# Altium schematic sheet MSP432.SchDoc: MSP432 Wiring
size A; Date: 3/13/2021; Author: Jesse Fernandez; CompanyName: GVSU; DrawnBy: Jesse Fernandez; Organization: Kennedy Hall of Engineering; Address1: 301 Fulton St. W; Address2: Grand Rapids, MI 49504; DocumentNumber: 1; Revision: 0.1; SheetNumber: 2; SheetTotal: 7; Time: 5:42 am
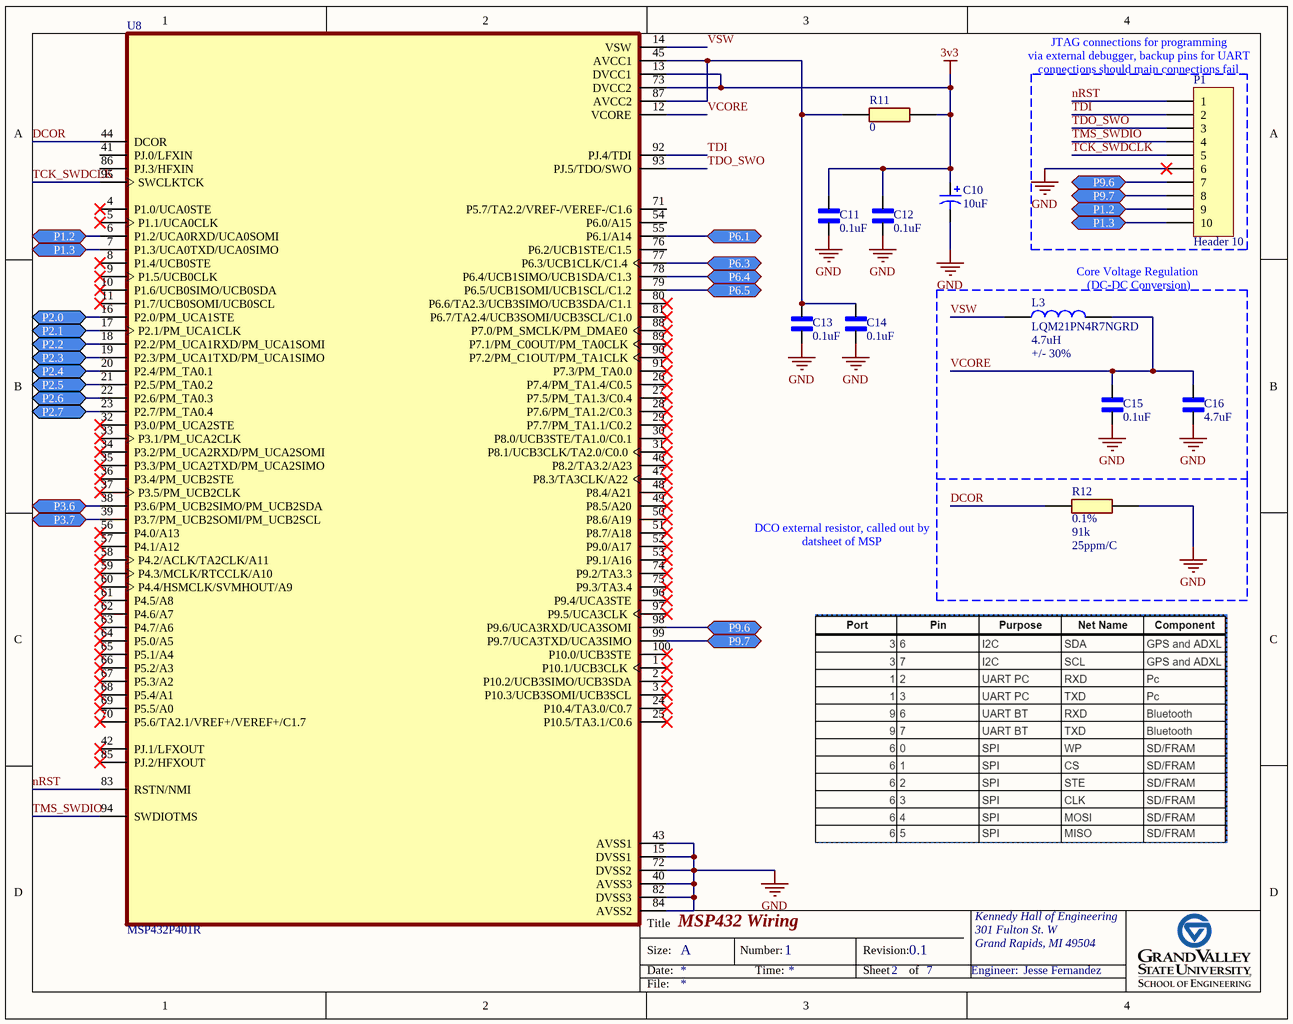
[diagram p0: MSP432.SchDoc]

## Parts
C10  value 10uF  [1206p]  (hidden comment: Cp1206)
C11  value 0.1uF  [CAPC1005X55N]  (hidden comment: Multilayer Ceramic Cap. 0402 (1005 Metric))
C12  value 0.1uF  [CAPC1005X55N]  (hidden comment: Multilayer Ceramic Cap. 0402 (1005 Metric))
C13  value 0.1uF  [CAPC1005X55N]  (hidden comment: Multilayer Ceramic Cap. 0402 (1005 Metric))
C14  value 0.1uF  [CAPC1005X55N]  (hidden comment: Multilayer Ceramic Cap. 0402 (1005 Metric))
C15  value 0.1uF  [CAPC1005X55N]  (hidden comment: Multilayer Ceramic Cap. 0402 (1005 Metric))
C16  value 4.7uF  [CAPC1005X55N]  (hidden comment: Multilayer Ceramic Cap. 0402 (1005 Metric))
L3  LQM21PN4R7NGRD  value 4.7uH  Tolerance: +/- 30%  [LQM21PN4R7NGRD]
P1  Header 10  [HDR1X10]
R11  value 0  [Resistor 0603]  (hidden comment: Resistor 0603)
R12  value 91k  Tolerance: 0.1%  Temperature Coefficient: 25ppm/C  [Resistor 0603]  (hidden comment: Resistor 0603)
U8  MSP432P401R  [MSP432P401R]

## Ports
P1.2 (bidir), P1.3 (bidir), P2.0 (bidir), P2.1 (bidir), P2.2 (bidir), P2.3 (bidir), P2.4 (bidir), P2.5 (bidir), P2.6 (bidir), P2.7 (bidir), P3.6 (bidir), P3.7 (bidir), P6.1 (bidir), P6.3 (bidir), P6.4 (bidir), P6.5 (bidir), P9.6 (bidir), P9.7 (bidir)

## Nets
3v3: C10.1 C11.2 C12.2 R11.2 U8.13(DVCC1) U8.73(DVCC2)
GND: C10.2 C11.1 C12.1 C13.1 C14.1 C15.1 C16.1 P1.6 R12.2 U8.15(DVSS1) U8.40(AVSS3) U8.43(AVSS1) U8.72(DVSS2) U8.82(DVSS3) U8.84(AVSS2)
DCOR: R12.1 U8.44(DCOR)
nRST: P1.1 U8.83(RSTN/NMI)
P1.2: P1.9 U8.6(P1.2/UCA0RXD/UCA0SOMI) ; port P1.2
P1.3: P1.10 U8.7(P1.3/UCA0TXD/UCA0SIMO) ; port P1.3
P2.0: U8.16(P2.0/PM_UCA1STE) ; port P2.0
P2.1: U8.17(P2.1/PM_UCA1CLK) ; port P2.1
P2.2: U8.18(P2.2/PM_UCA1RXD/PM_UCA1SOMI) ; port P2.2
P2.3: U8.19(P2.3/PM_UCA1TXD/PM_UCA1SIMO) ; port P2.3
P2.4: U8.20(P2.4/PM_TA0.1) ; port P2.4
P2.5: U8.21(P2.5/PM_TA0.2) ; port P2.5
P2.6: U8.22(P2.6/PM_TA0.3) ; port P2.6
P2.7: U8.23(P2.7/PM_TA0.4) ; port P2.7
P3.6: U8.38(P3.6/PM_UCB2SIMO/PM_UCB2SDA) ; port P3.6
P3.7: U8.39(P3.7/PM_UCB2SOMI/PM_UCB2SCL) ; port P3.7
P6.1: U8.55(P6.1/A14) ; port P6.1
P6.3: U8.77(P6.3/UCB1CLK/C1.4) ; port P6.3
P6.4: U8.78(P6.4/UCB1SIMO/UCB1SDA/C1.3) ; port P6.4
P6.5: U8.79(P6.5/UCB1SOMI/UCB1SCL/C1.2) ; port P6.5
P9.6: P1.7 U8.98(P9.6/UCA3RXD/UCA3SOMI) ; port P9.6
P9.7: P1.8 U8.99(P9.7/UCA3TXD/UCA3SIMO) ; port P9.7
TCK_SWDCLK: P1.5 U8.95(SWCLKTCK)
TDI: P1.2 U8.92(PJ.4/TDI)
TDO_SWO: P1.3 U8.93(PJ.5/TDO/SWO)
TMS_SWDIO: P1.4 U8.94(SWDIOTMS)
VCORE: C15.2 C16.2 L3.2 U8.12(VCORE)
VSW: L3.1 U8.14(VSW)
NetC13_2: C13.2 C14.2 R11.1 U8.45(AVCC1) U8.87(AVCC2)

Not connected (* = marked no-connect by the designer): U8 1(P10.1/UCB3CLK)* 2(P10.2/UCB3SIMO/UCB3SDA)* 3(P10.3/UCB3SOMI/UCB3SCL)* 4(P1.0/UCA0STE)* 5(P1.1/UCA0CLK)* 8(P1.4/UCB0STE)* 9(P1.5/UCB0CLK)* 10(P1.6/UCB0SIMO/UCB0SDA)* 11(P1.7/UCB0SOMI/UCB0SCL)* 24(P10.4/TA3.0/C0.7)* 25(P10.5/TA3.1/C0.6)* 26(P7.4/PM_TA1.4/C0.5)* 27(P7.5/PM_TA1.3/C0.4)* 28(P7.6/PM_TA1.2/C0.3)* 29(P7.7/PM_TA1.1/C0.2)* 30(P8.0/UCB3STE/TA1.0/C0.1)* 31(P8.1/UCB3CLK/TA2.0/C0.0)* 32(P3.0/PM_UCA2STE)* 33(P3.1/PM_UCA2CLK)* 34(P3.2/PM_UCA2RXD/PM_UCA2SOMI)* 35(P3.3/PM_UCA2TXD/PM_UCA2SIMO)* 36(P3.4/PM_UCB2STE)* 37(P3.5/PM_UCB2CLK)* 41(PJ.0/LFXIN) 42(PJ.1/LFXOUT)* 46(P8.2/TA3.2/A23)* 47(P8.3/TA3CLK/A22)* 48(P8.4/A21)* 49(P8.5/A20)* 50(P8.6/A19)* 51(P8.7/A18)* 52(P9.0/A17)* 53(P9.1/A16)* 54(P6.0/A15) 56(P4.0/A13)* 57(P4.1/A12)* 58(P4.2/ACLK/TA2CLK/A11)* 59(P4.3/MCLK/RTCCLK/A10)* 60(P4.4/HSMCLK/SVMHOUT/A9)* 61(P4.5/A8)* 62(P4.6/A7)* 63(P4.7/A6)* 64(P5.0/A5)* 65(P5.1/A4)* 66(P5.2/A3)* 67(P5.3/A2)* 68(P5.4/A1)* 69(P5.5/A0)* 70(P5.6/TA2.1/VREF+/VEREF+/C1.7)* 71(P5.7/TA2.2/VREF-/VEREF-/C1.6) 74(P9.2/TA3.3)* 75(P9.3/TA3.4)* 76(P6.2/UCB1STE/C1.5) 80(P6.6/TA2.3/UCB3SIMO/UCB3SDA/C1.1)* 81(P6.7/TA2.4/UCB3SOMI/UCB3SCL/C1.0)* 85(PJ.2/HFXOUT)* 86(PJ.3/HFXIN) 88(P7.0/PM_SMCLK/PM_DMAE0)* 89(P7.1/PM_C0OUT/PM_TA0CLK)* 90(P7.2/PM_C1OUT/PM_TA1CLK)* 91(P7.3/PM_TA0.0)* 96(P9.4/UCA3STE)* 97(P9.5/UCA3CLK)* 100(P10.0/UCB3STE)*

## Notes on the sheet
- (near P1) JTAG connections for programming
  via external debugger, backup pins for UART connections should main connections fail
- (near L3) Core Voltage Regulation
  (DC-DC Conversion)
- DCO external resistor, called out by datsheet of MSP
- Title
- Size:
- Date:
- A
- Number:
- Time:
- Revision:
- Sheet
- of
- Engineer:
- File:

## Library data of the parts
C10 = Cp1206: 1206 Polarized Chip Capacitor - Standard
C11-C15 = Multilayer Ceramic Cap. 0402 (1005 Metric): Capacitor X6S 0402 (1005 Metric); Manufacturer: Murata Electronics; Manufacturer P/N: GRM155R71H104KE14D; Vendor: Mouser; Vendor P/N: 81-GRM155R71H104KE4D; Tolerance: 10%; Price: $0.10; ComponentLink1Description: Datasheet; ComponentLink1URL: *
C16 = Multilayer Ceramic Cap. 0402 (1005 Metric): Capacitor X6S 0402 (1005 Metric); Manufacturer: TDK; Manufacturer P/N: C1005X5R0J475K050BE; Vendor: Mouser; Vendor P/N: 810-C1005X5R0J475KE; Tolerance: 10%; Price: $0.43; ComponentLink1Description: Datasheet; ComponentLink1URL: *
L3 = LQM21PN4R7NGRD: Fixed Inductors 0805 4.7uH +/-30% 30MHz 0.8A 0.23ohms; Manufacturer: Murata Electronics; Vendor: Mouser; Vendor P/N: 81-LQM21PN4R7NGRDRD; Manufacturer P/N: LQM21PN4R7NGRD; Price: $0.32; ComponentLink1Description: Datasheet; ComponentLink1URL: https://www.mouser.com/datasheet/2/281/JELF243B-0026-1634204.pdf
P1 = Header 10: Header, 10-Pin; LatestRevisionDate: 17-Jul-2002; LatestRevisionNote: Re-released for DXP Platform.; Publisher: Altium Limited
R11 = Resistor 0603: Manufacturer: Vishay / Dale; Manufacturer P/N: CRCW06030000Z0EA; Vendor: Mouser; Vendor P/N: 71-CRCW0603-0-E3; Tolerance: *tolerance*; Price: $0.10
R12 = Resistor 0603: Manufacturer: Vishay / Dale; Manufacturer P/N: TNPW060391K0BEEA; Vendor: Mouser; Vendor P/N: 71-TNPW060391K0BEEA; Price: $1.28
U8 = MSP432P401R: ARM® Cortex®-M4F MSP432™ Microcontroller IC 32-Bit 48MHz 256KB (256K x 8) FLASH 100-LQFP (14x14); Manufacturer: Texas Instruments; Manufactuer P/N: MSP432P401RIPZ; Vendor: Digikey Corp.; Vendor P/N: 296-46884-ND; Price: $9.32; ComponentLink1Description: Datasheet; ComponentLink1URL: https://www.ti.com/lit/ds/symlink/msp432p401r.pdf?HQS=dis-dk-null-digikeymode-dsf-pf-null-wwe&ts=1615260095027